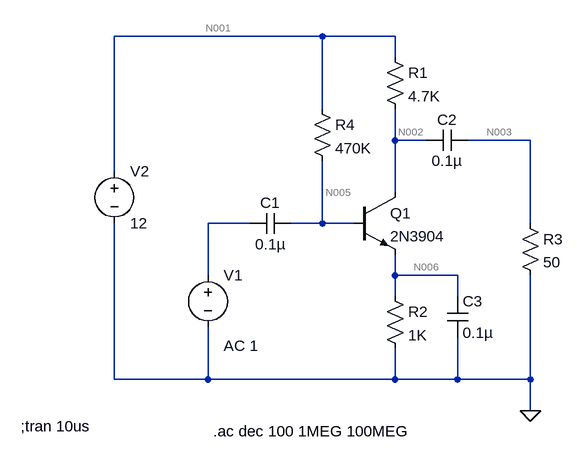
[diagram p0: schematic Better_Number2.asc]
Better_Number2.asc, the LTspice schematic file:
Version 4
SHEET 1 880 680
WIRE 128 -128 -192 -128
WIRE 240 -128 128 -128
WIRE 240 -96 240 -128
WIRE 128 -16 128 -128
WIRE 240 32 240 -16
WIRE 288 32 240 32
WIRE 448 32 352 32
WIRE -192 80 -192 -128
WIRE 240 112 240 32
WIRE 16 160 -48 160
WIRE 128 160 128 64
WIRE 128 160 80 160
WIRE 176 160 128 160
WIRE 448 160 448 32
WIRE -48 240 -48 160
WIRE 240 240 240 208
WIRE 336 240 240 240
WIRE 240 272 240 240
WIRE 336 272 336 240
WIRE -192 400 -192 160
WIRE -48 400 -48 320
WIRE -48 400 -192 400
WIRE 240 400 240 352
WIRE 240 400 -48 400
WIRE 336 400 336 336
WIRE 336 400 240 400
WIRE 448 400 448 240
WIRE 448 400 336 400
WIRE 448 448 448 400
FLAG 448 448 0
SYMBOL npn 176 112 R0
SYMATTR InstName Q1
SYMATTR Value 2N3904
SYMBOL cap 80 144 R90
WINDOW 0 0 32 VBottom 2
WINDOW 3 32 32 VTop 2
SYMATTR InstName C1
SYMATTR Value 0.1µ
SYMBOL res 224 -112 R0
SYMATTR InstName R1
SYMATTR Value 4.7K
SYMBOL voltage -48 224 R0
WINDOW 123 24 124 Left 2
WINDOW 39 0 0 Left 0
SYMATTR Value2 AC 1
SYMATTR InstName V1
SYMATTR Value ""
SYMBOL voltage -192 64 R0
SYMATTR InstName V2
SYMATTR Value 12
SYMBOL cap 352 16 R90
WINDOW 0 0 32 VBottom 2
WINDOW 3 32 32 VTop 2
SYMATTR InstName C2
SYMATTR Value 0.1µ
SYMBOL res 432 144 R0
SYMATTR InstName R3
SYMATTR Value 50
SYMBOL res 224 256 R0
SYMATTR InstName R2
SYMATTR Value 1K
SYMBOL cap 320 272 R0
SYMATTR InstName C3
SYMATTR Value 0.1µ
SYMBOL res 112 -32 R0
SYMATTR InstName R4
SYMATTR Value 470K
TEXT -336 472 Left 2 !;tran 10us
TEXT -40 480 Left 2 !.ac dec 100 1MEG 100MEG

The netlist it stands for:
* Better_Number2.asc
Q1 N002 N005 N006 0 2N3904
C1 N005 N004 0.1µ
R1 N001 N002 4.7K
V1 N004 0 AC 1
V2 N001 0 12
C2 N003 N002 0.1µ
R3 N003 0 50
R2 N006 0 1K
C3 N006 0 0.1µ
R4 N001 N005 470K
.model NPN NPN
.model PNP PNP
.lib standard.bjt
;tran 10us
.ac dec 100 1MEG 100MEG
.backanno
.end

* Results of the author's LTspice run, read from the files saved beside the schematic
* Operating Point, zero values left out:
*   V(n002) = 2.202 V
*   V(n005) = 2.78 V
*   V(n006) = 2.104 V
*   V(n001) = 12 V
*   Ic(Q1) = 2.085 mA
*   Ib(Q1) = 19.62 µA
*   Ie(Q1) = -2.104 mA
*   I(R4) = 19.62 µA
*   I(R2) = 2.104 mA
*   I(R1) = 2.085 mA
*   I(V2) = -2.104 mA
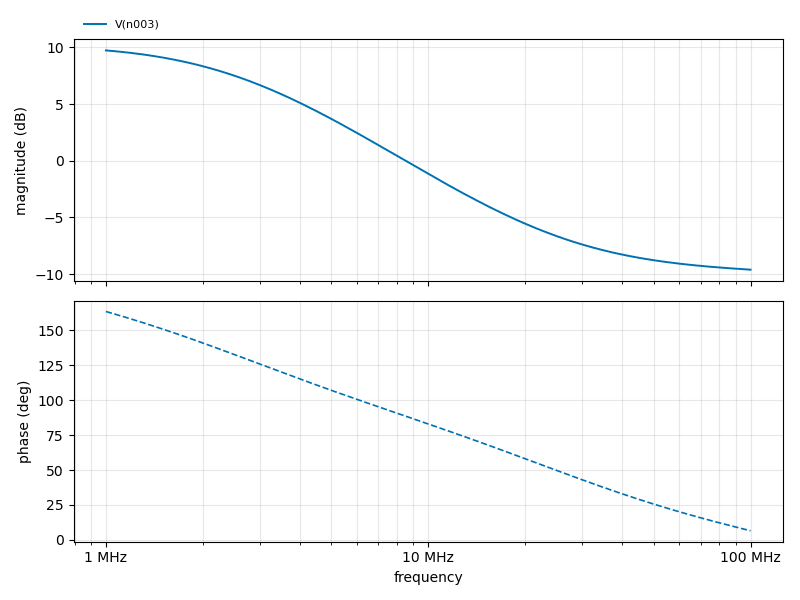
[diagram p1: AC Analysis of Better_Number2.asc, plotted from the saved traces]
* AC Analysis, 1 run:
*   V(n003): 9.72 dB at 1 MHz, -9.60 dB at 100 MHz, peak 9.72 dB at 1 MHz, 3 dB below the peak at 2.976 MHz